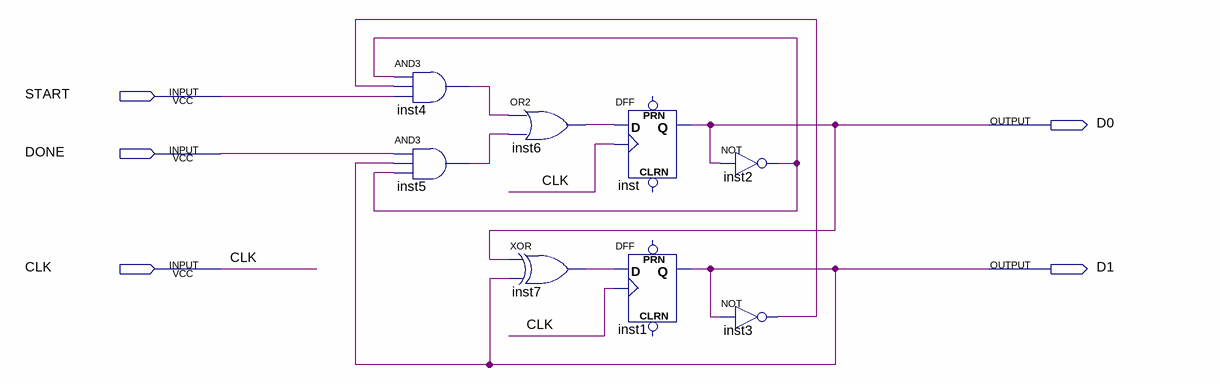
[diagram p0: schematic sheet]
// Quartus schematic FSM_MUL.bdf as structural Verilog: 8 symbols, 5 pins
module FSM_MUL (
  input  START,
  input  DONE,
  input  CLK,
  output D0,
  output D1
);

  wire inst2_out, inst3_out, inst4_out, inst5_out, inst6_out, inst7_out;

  and inst4 (inst4_out, inst2_out, inst3_out, START);
  and inst5 (inst5_out, DONE, D1, inst2_out);
  or inst6 (inst6_out, inst4_out, inst5_out);
  xor inst7 (inst7_out, D0, D1);
  DFF inst (.CLK(CLK), .D(inst6_out), .Q(D0));  // open: CLRN, PRN
  DFF inst1 (.CLK(CLK), .D(inst7_out), .Q(D1));  // open: CLRN, PRN
  not inst2 (inst2_out, D0);
  not inst3 (inst3_out, D1);
endmodule
